# Altium project CPU_USB.PrjPcb
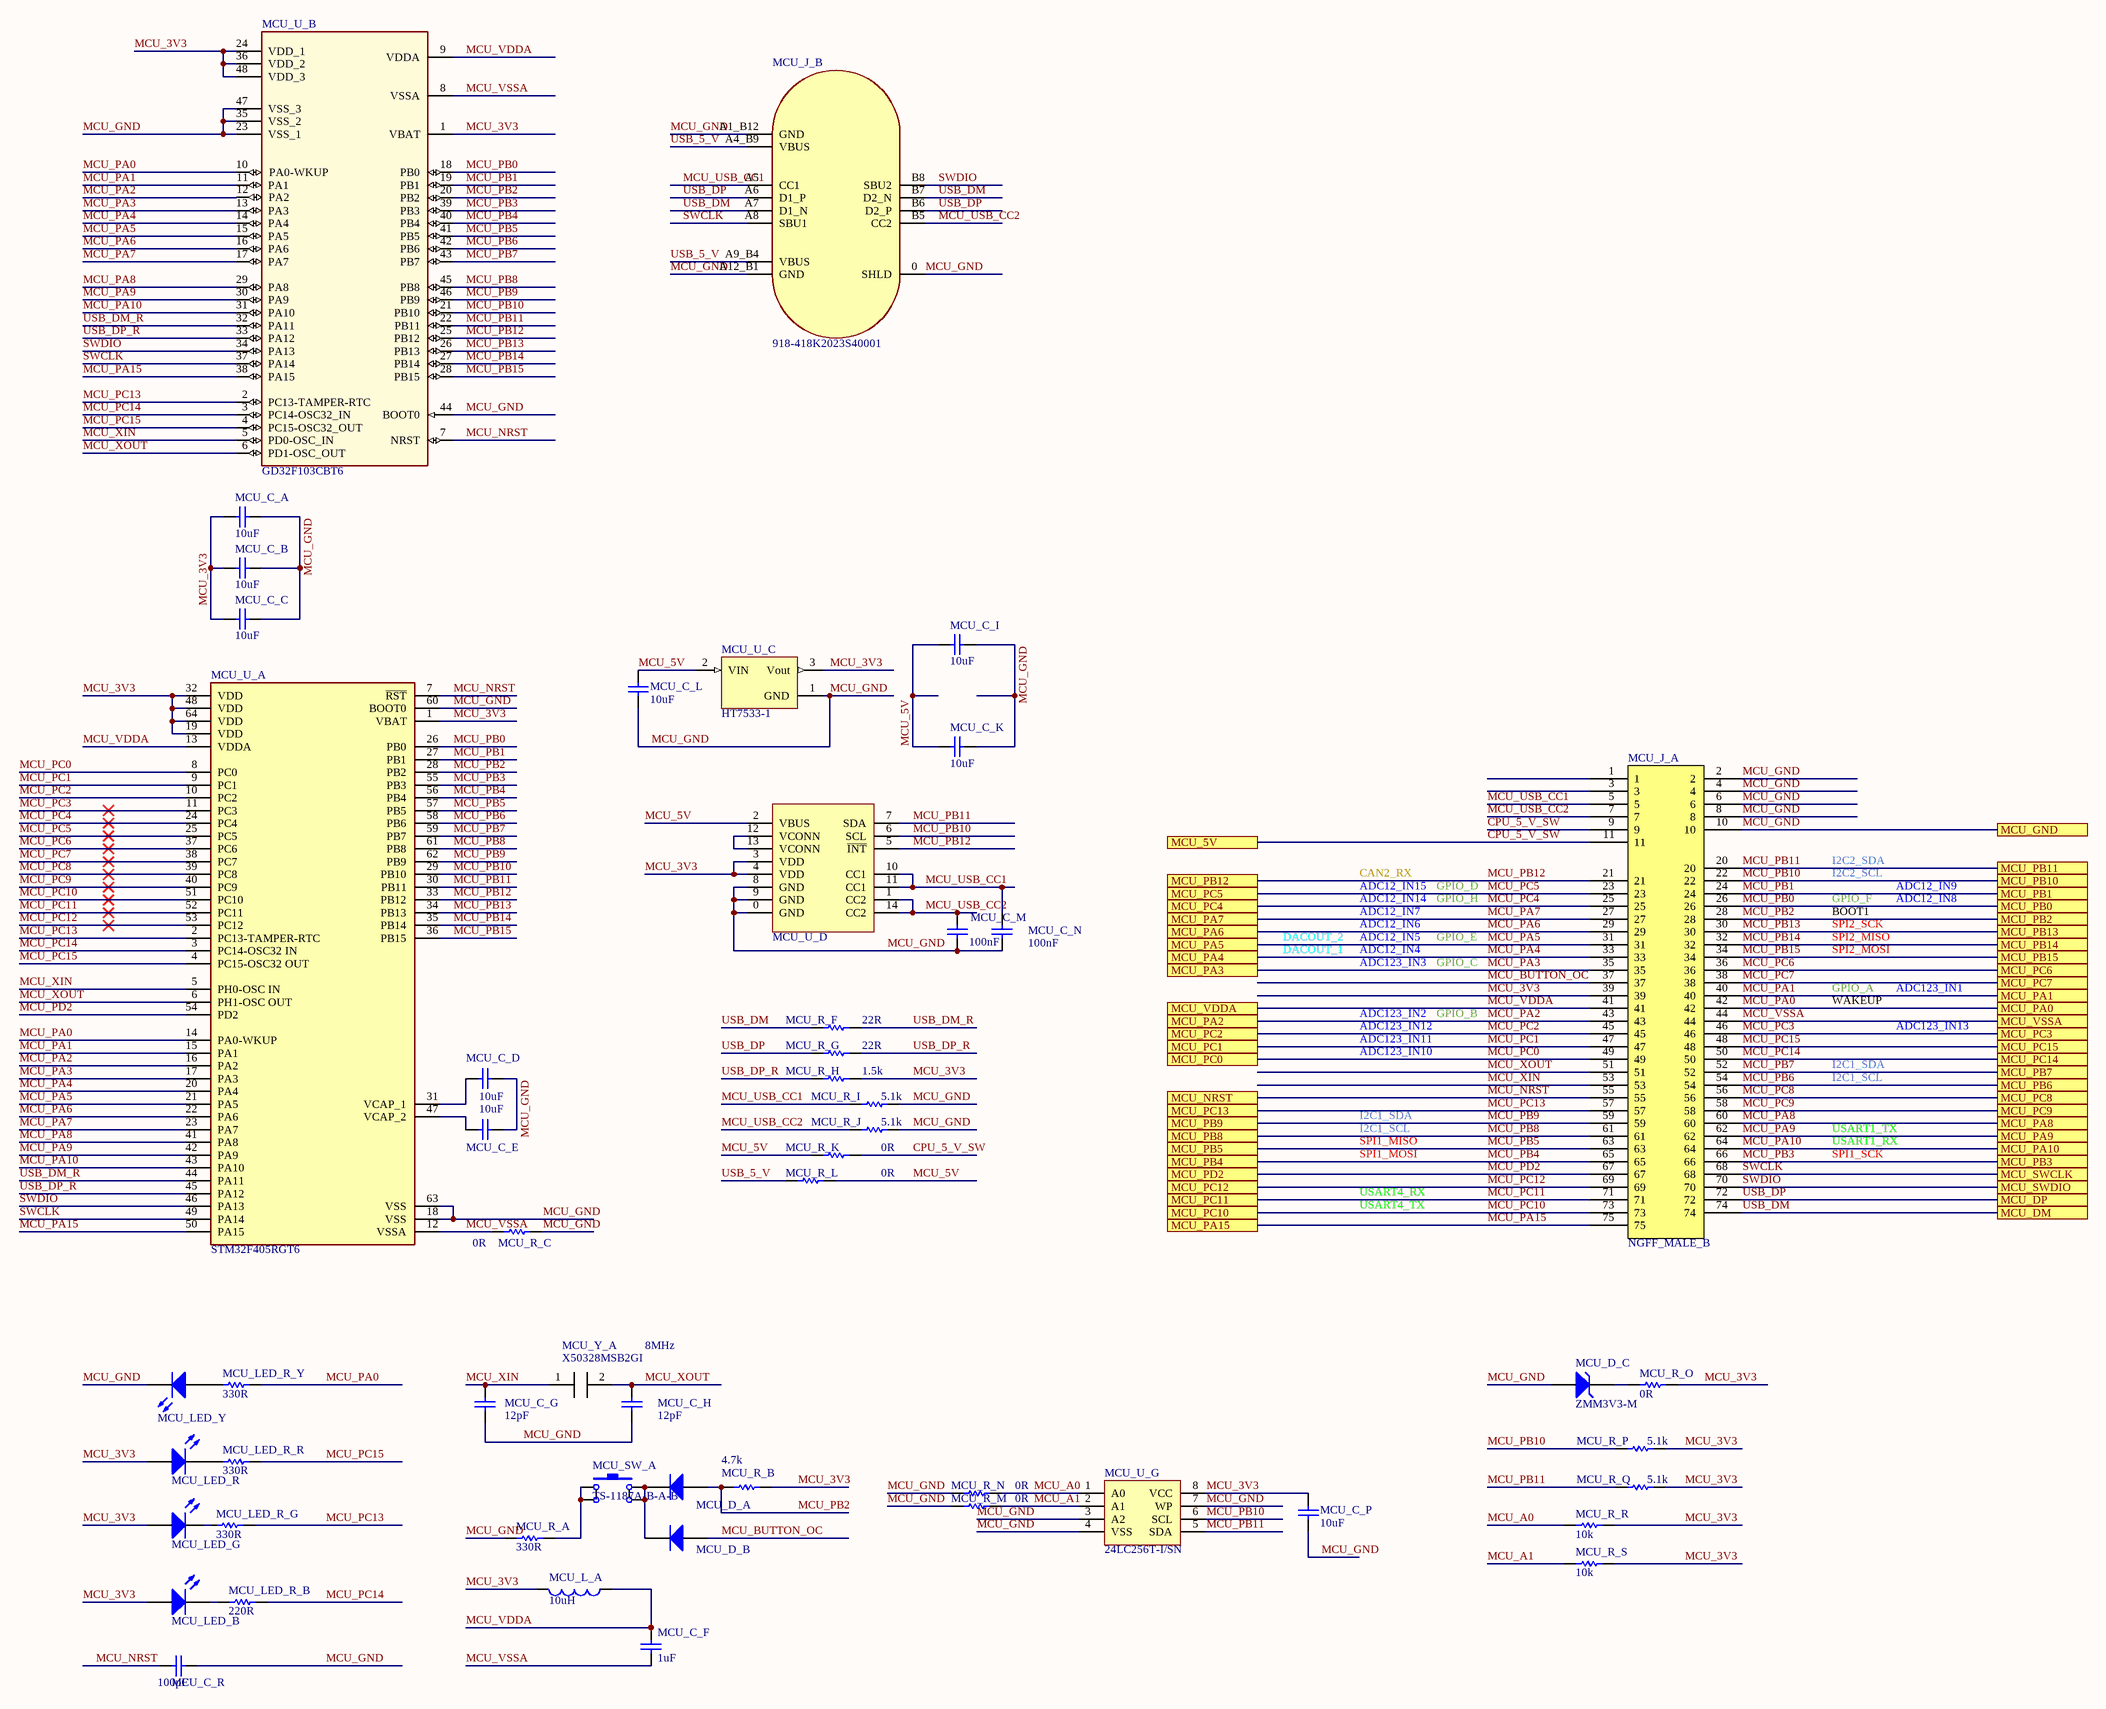
[diagram p0: CPU.SchDoc]
2 sheets, 76 parts. Net scope: flat (ports and power ports of the same name join across sheets).
Board file: CPU.PcbDoc
Sheets:
  CPU.SchDoc
  AFE.SchDoc

## Sheet CPU.SchDoc
size C

### Parts
MCU_C_A  value 10uF  [C_0402]  (hidden comment: CL05A106MQ5NUNC)
MCU_C_B  value 10uF  [C_0402]  (hidden comment: CL05A106MQ5NUNC)
MCU_C_C  value 10uF  [C_0402]  (hidden comment: CL05A106MQ5NUNC)
MCU_C_D  value 10uF  [C_0402]  (hidden comment: CL05A106MQ5NUNC)
MCU_C_E  value 10uF  [C_0402]  (hidden comment: CL05A106MQ5NUNC)
MCU_C_F  value 1uF  [C_0402]  (hidden comment: CL05A105KA5NQNC)
MCU_C_G  value 12pF  [C_0402]  (hidden comment: 0402CG120J500NT)
MCU_C_H  value 12pF  [C_0402]  (hidden comment: 0402CG120J500NT)
MCU_C_I  value 10uF  [C_0402]  (hidden comment: CL05A106MQ5NUNC)
MCU_C_K  value 10uF  [C_0402]  (hidden comment: CL05A106MQ5NUNC)
MCU_C_L  value 10uF  [C_0805]  (hidden comment: CL21A106KAYNNNE)
MCU_C_M  value 100nF  [C_0402]  (hidden comment: CL05B104KO5NNNC)
MCU_C_N  value 100nF  [C_0402]  (hidden comment: CL05B104KO5NNNC)
MCU_C_P  value 10uF  [C_0402]  (hidden comment: CL05A106MQ5NUNC)
MCU_C_R  value 100pF  [C_0402]  (hidden comment: 0402CG101J500NT)
MCU_D_A  1N4148WS  [SOD-323]  (value not drawn)
MCU_D_B  1N4148WS  [SOD-323]  (value not drawn)
MCU_D_C  ZMM3V3-M  [DO-213AA]
MCU_J_A  NGFF_MALE_B  [NGFF_MALE_B]
MCU_J_B  918-418K2023S40001  [918-418K2023S40001]
MCU_L_A  value 10uH  [L_0603]  (hidden comment: SDFL1608S100KTF)
MCU_LED_B  19-217/BHC-ZL1M2RY/3T  [D_0603]  (value not drawn)
MCU_LED_G  19-217/GHC-YR1S2/3T  [D_0603]  (value not drawn)
MCU_LED_R  KT-0603R  [D_0603]  (value not drawn)
MCU_LED_R_B  value 220R  [R_0402]  (hidden comment: 0402WGF2200TCE)
MCU_LED_R_G  value 330R  [R_0402]  (hidden comment: 0402WGF3300TCE)
MCU_LED_R_R  value 330R  [R_0402]  (hidden comment: 0402WGF3300TCE)
MCU_LED_R_Y  value 330R  [R_0402]  (hidden comment: 0402WGF3300TCE)
MCU_LED_Y  19-21UYC/S530-A4/TR8  [D_0603]  (value not drawn)
MCU_R_A  value 330R  [R_0402]  (hidden comment: 0402WGF3300TCE)
MCU_R_B  value 4.7k  [R_0402]  (hidden comment: 0402WGF4701TCE)
MCU_R_C  value 0R  [R_0402]  (hidden comment: 0402WGF0000TCE)
MCU_R_F  value 22R  [R_0402]  (hidden comment: 0402WGF220JTCE)
MCU_R_G  value 22R  [R_0402]  (hidden comment: 0402WGF220JTCE)
MCU_R_H  value 1.5k  [R_0402]  (hidden comment: 0402WGF1501TCE)
MCU_R_I  value 5.1k  [R_0402]  (hidden comment: 0402WGF5101TCE)
MCU_R_J  value 5.1k  [R_0402]  (hidden comment: 0402WGF5101TCE)
MCU_R_K  value 0R  [R_0402]  (hidden comment: 0402WGF0000TCE)
MCU_R_L  value 0R  [R_0402]  (hidden comment: 0402WGF0000TCE)
MCU_R_M  value 0R  [R_0402]  (hidden comment: 0402WGF0000TCE)
MCU_R_N  value 0R  [R_0402]  (hidden comment: 0402WGF0000TCE)
MCU_R_O  value 0R  [R_0402]  (hidden comment: 0402WGF0000TCE)
MCU_R_P  value 5.1k  [R_0402]  (hidden comment: 0402WGF5101TCE)
MCU_R_Q  value 5.1k  [R_0402]  (hidden comment: 0402WGF5101TCE)
MCU_R_R  value 10k  [R_0402]  (hidden comment: 0402WGF1002TCE)
MCU_R_S  value 10k  [R_0402]  (hidden comment: 0402WGF1002TCE)
MCU_SW_A  TS-1187A-B-A-B  [TS-1187A-C-C-B]
MCU_U_A  STM32F405RGT6  [QFP-64-P0.5MM]
MCU_U_B  GD32F103CBT6  [QFP-48-P0.5MM]
MCU_U_C  HT7533-1  [SOT-223-3]
MCU_U_D  FUSB302BMPX  [QFN-14-P0.5MM]  (value not drawn)
MCU_U_G  24LC256T-I/SN  [SOIC-8-P1.27-W3.5]
MCU_Y_A  X50328MSB2GI  value 8MHz  [YSX530GA]

### Ports
MCU_5V, MCU_DM, MCU_DP, MCU_GND, MCU_NRST, MCU_PA0, MCU_PA1, MCU_PA2, MCU_PA3, MCU_PA4, MCU_PA5, MCU_PA6, MCU_PA7, MCU_PA8, MCU_PA9, MCU_PA10, MCU_PA15, MCU_PB0, MCU_PB1, MCU_PB2, MCU_PB3, MCU_PB4, MCU_PB5, MCU_PB6, MCU_PB7, MCU_PB8, MCU_PB9, MCU_PB10, MCU_PB11, MCU_PB12, MCU_PB13, MCU_PB14, MCU_PB15, MCU_PC0, MCU_PC1, MCU_PC2, MCU_PC3, MCU_PC4, MCU_PC5, MCU_PC6, MCU_PC7, MCU_PC8, MCU_PC9, MCU_PC10, MCU_PC11, MCU_PC12, MCU_PC13, MCU_PC14, MCU_PC15, MCU_PD2, MCU_SWCLK, MCU_SWDIO, MCU_VDDA, MCU_VSSA

### Nets
CPU_5_V_SW: MCU_J_A.9 MCU_J_A.11 MCU_R_K.1 ; port MCU_5V
MCU_3V3: MCU_C_A.1 MCU_C_B.1 MCU_C_C.1 MCU_C_P.2 MCU_J_A.39 MCU_L_A.2 MCU_LED_B.2(A) MCU_LED_G.2(A) MCU_LED_R.2(A) MCU_R_B.1 MCU_R_H.2 MCU_R_O.2 MCU_R_P.2 MCU_R_Q.2 MCU_R_R.2 MCU_R_S.2 MCU_U_A.1(VBAT) MCU_U_A.19(VDD) MCU_U_A.32(VDD) MCU_U_A.48(VDD) MCU_U_A.64(VDD) MCU_U_B.1(VBAT) MCU_U_B.24(VDD_1) MCU_U_B.36(VDD_2) MCU_U_B.48(VDD_3) MCU_U_C.3(Vout) MCU_U_D.3(VDD) MCU_U_D.4(VDD) MCU_U_G.8(VCC)
MCU_5V: MCU_C_I.1 MCU_C_K.1 MCU_C_L.2 MCU_R_K.2 MCU_R_L.1 MCU_U_C.2(VIN) MCU_U_D.2(VBUS)
MCU_A0: MCU_R_N.1 MCU_R_R.1 MCU_U_G.1(A0)
MCU_A1: MCU_R_M.1 MCU_R_S.1 MCU_U_G.2(A1)
MCU_BUTTON_OC: MCU_D_B.2(A) MCU_J_A.37
MCU_GND: MCU_C_A.2 MCU_C_B.2 MCU_C_C.2 MCU_C_D.2 MCU_C_E.2 MCU_C_G.1 MCU_C_H.1 MCU_C_I.2 MCU_C_K.2 MCU_C_L.1 MCU_C_M.2 MCU_C_N.2 MCU_C_P.1 MCU_C_R.1 MCU_D_C.2(A) MCU_J_A.2 MCU_J_A.4 MCU_J_A.6 MCU_J_A.8 MCU_J_A.10 MCU_J_B.0(SHLD) MCU_J_B.A1_B12(GND) MCU_J_B.A12_B1(GND) MCU_LED_Y.1(K) MCU_R_A.2 MCU_R_C.1 MCU_R_I.2 MCU_R_J.2 MCU_R_M.2 MCU_R_N.2 MCU_U_A.18(VSS) MCU_U_A.60(BOOT0) MCU_U_A.63(VSS) MCU_U_B.23(VSS_1) MCU_U_B.35(VSS_2) MCU_U_B.44(BOOT0) MCU_U_B.47(VSS_3) MCU_U_C.1(GND) MCU_U_D.0(GND) MCU_U_D.8(GND) MCU_U_D.9(GND) MCU_U_G.3(A2) MCU_U_G.4(VSS) MCU_U_G.7(WP) ; port MCU_GND
MCU_NRST: MCU_C_R.2 MCU_J_A.55 MCU_U_A.7(~{RST}) MCU_U_B.7(NRST) ; port MCU_NRST
MCU_PA0: MCU_J_A.42 MCU_LED_R_Y.1 MCU_U_A.14(PA0-WKUP) MCU_U_B.10(PA0-WKUP) ; port MCU_PA0
MCU_PA1: MCU_J_A.40 MCU_U_A.15(PA1) MCU_U_B.11(PA1) ; port MCU_PA1
MCU_PA2: MCU_J_A.43 MCU_U_A.16(PA2) MCU_U_B.12(PA2) ; port MCU_PA2
MCU_PA3: MCU_J_A.35 MCU_U_A.17(PA3) MCU_U_B.13(PA3) ; port MCU_PA3
MCU_PA4: MCU_J_A.33 MCU_U_A.20(PA4) MCU_U_B.14(PA4) ; port MCU_PA4
MCU_PA5: MCU_J_A.31 MCU_U_A.21(PA5) MCU_U_B.15(PA5) ; port MCU_PA5
MCU_PA6: MCU_J_A.29 MCU_U_A.22(PA6) MCU_U_B.16(PA6) ; port MCU_PA6
MCU_PA7: MCU_J_A.27 MCU_U_A.23(PA7) MCU_U_B.17(PA7) ; port MCU_PA7
MCU_PA8: MCU_J_A.60 MCU_U_A.41(PA8) MCU_U_B.29(PA8) ; port MCU_PA8
MCU_PA9: MCU_J_A.62 MCU_U_A.42(PA9) MCU_U_B.30(PA9) ; port MCU_PA9
MCU_PA10: MCU_J_A.64 MCU_U_A.43(PA10) MCU_U_B.31(PA10) ; port MCU_PA10
MCU_PA15: MCU_J_A.75 MCU_U_A.50(PA15) MCU_U_B.38(PA15) ; port MCU_PA15
MCU_PB0: MCU_J_A.26 MCU_U_A.26(PB0) MCU_U_B.18(PB0) ; port MCU_PB0
MCU_PB1: MCU_J_A.24 MCU_U_A.27(PB1) MCU_U_B.19(PB1) ; port MCU_PB1
MCU_PB2: MCU_D_A.2(A) MCU_J_A.28 MCU_R_B.2 MCU_U_A.28(PB2) MCU_U_B.20(PB2) ; port MCU_PB2
MCU_PB3: MCU_J_A.66 MCU_U_A.55(PB3) MCU_U_B.39(PB3) ; port MCU_PB3
MCU_PB4: MCU_J_A.65 MCU_U_A.56(PB4) MCU_U_B.40(PB4) ; port MCU_PB4
MCU_PB5: MCU_J_A.63 MCU_U_A.57(PB5) MCU_U_B.41(PB5) ; port MCU_PB5
MCU_PB6: MCU_J_A.54 MCU_U_A.58(PB6) MCU_U_B.42(PB6) ; port MCU_PB6
MCU_PB7: MCU_J_A.52 MCU_U_A.59(PB7) MCU_U_B.43(PB7) ; port MCU_PB7
MCU_PB8: MCU_J_A.61 MCU_U_A.61(PB8) MCU_U_B.45(PB8) ; port MCU_PB8
MCU_PB9: MCU_J_A.59 MCU_U_A.62(PB9) MCU_U_B.46(PB9) ; port MCU_PB9
MCU_PB10: MCU_J_A.22 MCU_R_P.1 MCU_U_A.29(PB10) MCU_U_B.21(PB10) MCU_U_D.6(SCL) MCU_U_G.6(SCL) ; port MCU_PB10
MCU_PB11: MCU_J_A.20 MCU_R_Q.1 MCU_U_A.30(PB11) MCU_U_B.22(PB11) MCU_U_D.7(SDA) MCU_U_G.5(SDA) ; port MCU_PB11
MCU_PB12: MCU_J_A.21 MCU_U_A.33(PB12) MCU_U_B.25(PB12) MCU_U_D.5(~{INT}) ; port MCU_PB12
MCU_PB13: MCU_J_A.30 MCU_U_A.34(PB13) MCU_U_B.26(PB13) ; port MCU_PB13
MCU_PB14: MCU_J_A.32 MCU_U_A.35(PB14) MCU_U_B.27(PB14) ; port MCU_PB14
MCU_PB15: MCU_J_A.34 MCU_U_A.36(PB15) MCU_U_B.28(PB15) ; port MCU_PB15
MCU_PC0: MCU_J_A.49 MCU_U_A.8(PC0) ; port MCU_PC0
MCU_PC1: MCU_J_A.47 MCU_U_A.9(PC1) ; port MCU_PC1
MCU_PC2: MCU_J_A.45 MCU_U_A.10(PC2) ; port MCU_PC2
MCU_PC3: MCU_J_A.46 MCU_U_A.11(PC3) ; port MCU_PC3
MCU_PC4: MCU_J_A.25 MCU_U_A.24(PC4) ; port MCU_PC4
MCU_PC5: MCU_J_A.23 MCU_U_A.25(PC5) ; port MCU_PC5
MCU_PC6: MCU_J_A.36 MCU_U_A.37(PC6) ; port MCU_PC6
MCU_PC7: MCU_J_A.38 MCU_U_A.38(PC7) ; port MCU_PC7
MCU_PC8: MCU_J_A.56 MCU_U_A.39(PC8) ; port MCU_PC8
MCU_PC9: MCU_J_A.58 MCU_U_A.40(PC9) ; port MCU_PC9
MCU_PC10: MCU_J_A.73 MCU_U_A.51(PC10) ; port MCU_PC10
MCU_PC11: MCU_J_A.71 MCU_U_A.52(PC11) ; port MCU_PC11
MCU_PC12: MCU_J_A.69 MCU_U_A.53(PC12) ; port MCU_PC12
MCU_PC13: MCU_J_A.57 MCU_LED_R_G.1 MCU_U_A.2(PC13-TAMPER-RTC) MCU_U_B.2(PC13-TAMPER-RTC) ; port MCU_PC13
MCU_PC14: MCU_J_A.50 MCU_LED_R_B.1 MCU_U_A.3(PC14-OSC32_IN) MCU_U_B.3(PC14-OSC32_IN) ; port MCU_PC14
MCU_PC15: MCU_J_A.48 MCU_LED_R_R.1 MCU_U_A.4(PC15-OSC32_OUT) MCU_U_B.4(PC15-OSC32_OUT) ; port MCU_PC15
MCU_PD2: MCU_J_A.67 MCU_U_A.54(PD2) ; port MCU_PD2
MCU_USB_CC1: MCU_C_N.1 MCU_J_A.5 MCU_J_B.A5(CC1) MCU_R_I.1 MCU_U_D.10(CC1) MCU_U_D.11(CC1)
MCU_USB_CC2: MCU_C_M.1 MCU_J_A.7 MCU_J_B.B5(CC2) MCU_R_J.1 MCU_U_D.1(CC2) MCU_U_D.14(CC2)
MCU_VDDA: MCU_C_F.2 MCU_J_A.41 MCU_L_A.1 MCU_U_A.13(VDDA) MCU_U_B.9(VDDA) ; port MCU_VDDA
MCU_VSSA: MCU_C_F.1 MCU_J_A.44 MCU_R_C.2 MCU_U_A.12(VSSA) MCU_U_B.8(VSSA) ; port MCU_VSSA
MCU_XIN: MCU_C_G.2 MCU_J_A.53 MCU_U_A.5(PH0-OSC_IN) MCU_U_B.5(PD0-OSC_IN) MCU_Y_A.1
MCU_XOUT: MCU_C_H.2 MCU_J_A.51 MCU_U_A.6(PH1-OSC_OUT) MCU_U_B.6(PD1-OSC_OUT) MCU_Y_A.2
SWCLK: MCU_J_A.68 MCU_J_B.A8(SBU1) MCU_U_A.49(PA14) MCU_U_B.37(PA14) ; port MCU_SWCLK
SWDIO: MCU_J_A.70 MCU_J_B.B8(SBU2) MCU_U_A.46(PA13) MCU_U_B.34(PA13) ; port MCU_SWDIO
USB_5_V: MCU_J_B.A4_B9(VBUS) MCU_J_B.A9_B4(VBUS) MCU_R_L.2
USB_DM: MCU_J_A.74 MCU_J_B.A7(D1_N) MCU_J_B.B7(D2_N) MCU_R_F.1 ; port MCU_DM
USB_DM_R: MCU_R_F.2 MCU_U_A.44(PA11) MCU_U_B.32(PA11)
USB_DP: MCU_J_A.72 MCU_J_B.A6(D1_P) MCU_J_B.B6(D2_P) MCU_R_G.1 ; port MCU_DP
USB_DP_R: MCU_R_G.2 MCU_R_H.1 MCU_U_A.45(PA12) MCU_U_B.33(PA12)
NetMCU_C_D_1: MCU_C_D.1 MCU_U_A.31(VCAP_1)
NetMCU_C_E_1: MCU_C_E.1 MCU_U_A.47(VCAP_2)
NetMCU_D_A_1: MCU_D_A.1(K) MCU_D_B.1(K) MCU_SW_A.2 MCU_SW_A.2B
NetMCU_D_C_1: MCU_D_C.1(K) MCU_R_O.1
NetMCU_LED_B_1: MCU_LED_B.1(K) MCU_LED_R_B.2
NetMCU_LED_G_1: MCU_LED_G.1(K) MCU_LED_R_G.2
NetMCU_LED_R_1: MCU_LED_R.1(K) MCU_LED_R_R.2
NetMCU_LED_R_Y_2: MCU_LED_R_Y.2 MCU_LED_Y.2(A)
NetMCU_R_A_1: MCU_R_A.1 MCU_SW_A.1 MCU_SW_A.1B
NetMCU_U_D_12: MCU_U_D.12(VCONN) MCU_U_D.13(VCONN)

Not connected (* = marked no-connect by the designer): MCU_J_A 1 3

### Notes on the sheet
- ADC12_IN14
- ADC12_IN15
- CAN2_RX
- GPIO_D
- GPIO_H
- I2C2_SDA
- I2C2_SCL
- GPIO_F
- ADC12_IN8
- ADC12_IN9
- DACOUT_1
- DACOUT_2
- ADC12_IN4
- ADC12_IN5
- ADC12_IN6
- ADC12_IN7
- GPIO_E
- SPI2_SCK
- SPI2_MISO
- SPI2_MOSI
- BOOT1
- ADC123_IN2
- ADC123_IN3
- ADC123_IN12
- GPIO_B
- GPIO_C
- GPIO_A
- WAKEUP
- ADC123_IN1
- ADC123_IN13
- ADC123_IN10
- ADC123_IN11
- I2C1_SDA
- I2C1_SCL
- SPI1_MISO
- SPI1_MOSI
- USART1_TX
- USART1_RX
- SPI1_SCK
- USART4_RX
- USART4_TX

### Library data of the parts
MCU_C_A MCU_C_B MCU_C_C MCU_C_D MCU_C_E MCU_C_I MCU_C_K MCU_C_P = CL05A106MQ5NUNC: C - CAPACITOR - MLCC - 10uF - 6.3V - 0402; WVDC: 6.3; LCSC Part #: C15525; JLC Availability: Basic
MCU_C_F = CL05A105KA5NQNC: C - CAPACITOR - MLCC - 1uF - 25V - 0402; WVDC: 16; LCSC Part #: C52923; JLC Availability: Basic
MCU_C_G MCU_C_H = 0402CG120J500NT: C - CAPACITOR - MLCC - 12pF - 50V - 0402; WVDC: 50; LCSC Part #: C1547; JLC Availability: Basic
MCU_C_L = CL21A106KAYNNNE: C - CAPACITOR - MLCC - 10uF - 25V - 0805; WVDC: 25; LCSC Part #: C15850; Availability: Basic
MCU_C_M MCU_C_N = CL05B104KO5NNNC: C - CAPACITOR - MLCC - 100nF - 16V - 0402; WVDC: 16; LCSC Part #: C1525; JLC Availability: Basic
MCU_C_R = 0402CG101J500NT: C - CAPACITOR - MLCC - 100pF - 50V - 0402; LCSC Part #: C1546; JLC Availability: Extended
MCU_D_A MCU_D_B = 1N4148WS: D - DIODE - FAST TRR - 100V - 150mA - 4ns; LCSC Part #: C2128; JLC Availability: Basic; PIV: 100V; If: 150mA; Trr: 4ns
MCU_D_C = ZMM3V3-M: D - DIODE - ZENER - 3.3V - 500mW; LCSC Part #: C8056; JLC Availability: Basic
MCU_J_A = NGFF_MALE_B: J - JACK - NGFF Male Finger, B Key; Manufacturer: Kyocera; Manufacturer P/N: 245863050024829
MCU_J_B = 918-418K2023S40001: J - JACK - USB - Type C - Recepticle - SMT - 90°; JLC Availability: LCSC; LCSC Part #: C167321
MCU_L_A = SDFL1608S100KTF: L - INDUCTOR - 10uH - 0603; LCSC Part #: C1035; JLC Availability: Basic
MCU_LED_B = 19-217/BHC-ZL1M2RY/3T: D - LED - 0603 - Blue; LCSC Part #: C72041; JLC Availability: Basic
MCU_LED_G = 19-217/GHC-YR1S2/3T: D - LED - 0603 - Green; LCSC Part #: C72043; JLC Availability: Basic
MCU_LED_R = KT-0603R: D - LED - 0603 - Red; LCSC Part #: C2286; JLC Availability: Basic
MCU_LED_R_B = 0402WGF2200TCE: R - RESISTOR - SMD - 220R - 1% - 0402; LCSC Part #: C25091; JLC Availability: Basic
MCU_LED_R_G MCU_LED_R_R MCU_LED_R_Y MCU_R_A = 0402WGF3300TCE: R - RESISTOR - SMD - 330R - 1% - 0402; LCSC Part #: C25104; JLC Availability: Basic
MCU_LED_Y = 19-21UYC/S530-A4/TR8: D - LED - 0603 - Yellow (Sodium); LCSC Part #: C409441; JLC Availability: Extended
MCU_R_B = 0402WGF4701TCE: R - RESISTOR - SMD - 4.7k - 1% - 0402; LCSC Part #: C25900; JLC Availability: Basic
MCU_R_C MCU_R_K MCU_R_L MCU_R_M MCU_R_N MCU_R_O = 0402WGF0000TCE: R - RESISTOR - SMD - 0R - 1% - 0402; LCSC Part #: C17168; JLC Availability: Basic
MCU_R_F MCU_R_G = 0402WGF220JTCE: R - RESISTOR - SMD - 22R - 1% - 0402; LCSC Part #: C25092; JLC Availability: Basic
MCU_R_H = 0402WGF1501TCE: R - RESISTOR - SMD - 1.5k - 1% - 0402; LCSC Part #: C25867; JLC Availability: Basic
MCU_R_I MCU_R_J MCU_R_P MCU_R_Q = 0402WGF5101TCE: R - RESISTOR - SMD - 5.1k - 1% - 0402; LCSC Part #: C25905; JLC Availability: Basic
MCU_R_R MCU_R_S = 0402WGF1002TCE: R - RESISTOR - SMD - 10k - 1% - 0402; LCSC Part #: C25744; JLC Availability: Basic
MCU_SW_A = TS-1187A-B-A-B: SW - SWITCH - SPST - NO - Top Actuated Surface Mount; LCSC Part #: C318884; JLC Availability: Basic
MCU_U_A = STM32F405RGT6: U - IC - MCU 32BIT 1MB FLASH 64LQFP; ComponentLink2Description: Datasheet; ComponentLink1URL: https://upverter.com/upn/revision/179c87d5c3d4f257/; ComponentLink1Description: Upverter; ComponentLink2URL: http://www.st.com/content/ccc/resource/technical/document/datasheet/33/d4/6f/1d/df/0b/4c/6d/CD00161566.pdf/files/CD00161566.pdf/jcr:content/translations/en.CD00161566.pdf; LCSC Part #: C15742; JLC Availability: Extended
MCU_U_B = GD32F103CBT6: U - IC - MCU, 128 KB Flash, 20 KB Internal RAM, 37 I/Os, 48-pin LQFP, -40 to 85 degC; FLASH Size (Prog) (kB): 128; I/Os (High Current): 37; Internal RAM Size (kB): 20; Operating Frequency(F) (Processor speed) (MHz): 72; ComponentLink1Description: Manufacturer URL; ComponentLink1URL: http://www.st.com/web/en/home.html; ComponentLink2Description: Datasheet; ComponentLink2URL: http://www.st.com/st-web-ui/static/active/en/resource/technical/document/datasheet/CD00161566.pdf; ComponentLink3Description: Package Specification; ComponentLink3URL: http://www.st.com/st-web-ui/static/active/en/resource/technical/document/datasheet/DM00058181.pdf; LCSC Part #: C77979; JLC Availability: Extended
MCU_U_C = HT7533-1: U - IC - 3V3 Power Regulator; VOut: 3.3; LCSC Part #: C14289; JLC Availability: Basic
MCU_U_D = FUSB302BMPX: U - IC - USB PD PHY; JLC Availability: Extended; LCSC Part #: C442699
MCU_U_G = 24LC256T-I/SN: U - IC - EEPROM 256k; LCSC Part #: C5458; JLC Availability: Extended; Storage: 256k
MCU_Y_A = X50328MSB2GI: Y - RESONATOR - 8MHZ ±10PPM - SMD-5032; Availability: Basic; LCSC Part #: C115962

## Sheet AFE.SchDoc
size A
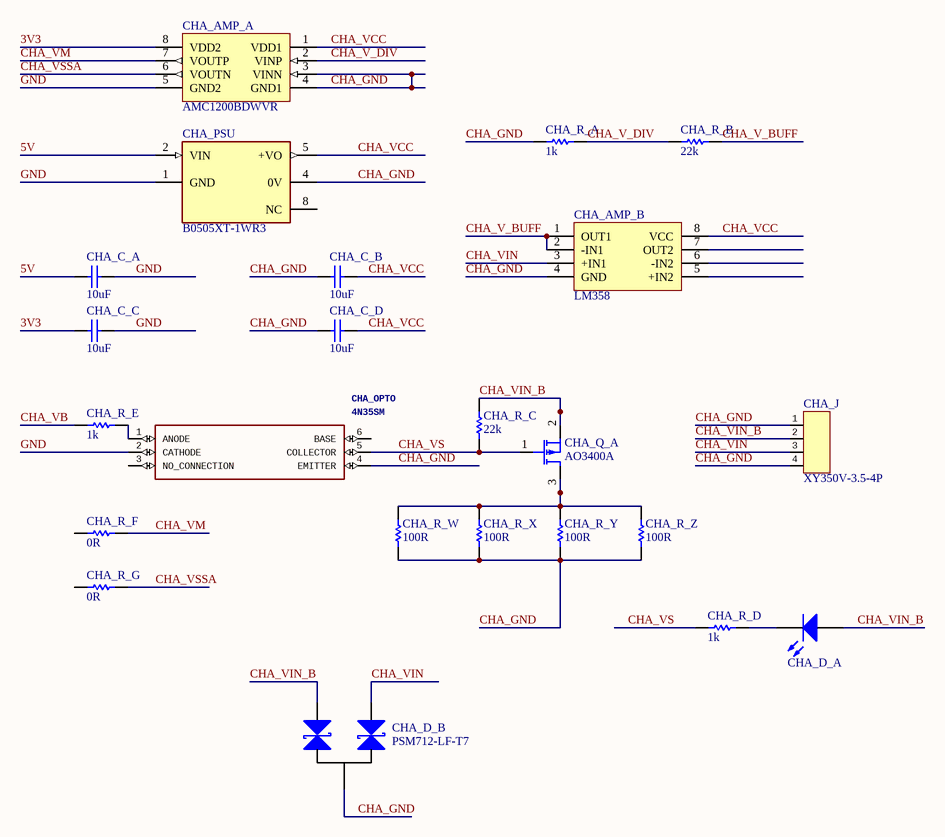
[diagram p1: AFE.SchDoc]

### Parts
CHA_AMP_A  AMC1200BDWVR  [SOIC-8-P1.27-W7.5]
CHA_AMP_B  LM358  [SOIC-8-P1.27-W3.5]
CHA_C_A  value 10uF  [C_0603]  (hidden comment: CL10A106MA8NRNC)
CHA_C_B  value 10uF  [C_0603]  (hidden comment: CL10A106MA8NRNC)
CHA_C_C  value 10uF  [C_0603]  (hidden comment: CL10A106MA8NRNC)
CHA_C_D  value 10uF  [C_0603]  (hidden comment: CL10A106MA8NRNC)
CHA_D_A  KT-0603R  [D_0603]  (value not drawn)
CHA_D_B  PSM712-LF-T7  [TO-236AB]
CHA_J  XY350V-3.5-4P  [XY350V-3.5-4P]
CHA_OPTO  4N35SM  [SOT254P916X508-6N]
CHA_PSU  B0505XT-1WR3  [CONV_B0512XT-1WR3]
CHA_Q_A  AO3400A  [TO-236AB]
CHA_R_A  value 1k  [R_0603]  (hidden comment: 0603WAF1001T5E)
CHA_R_B  value 22k  [R_0603]  (hidden comment: 0603WAF2202T5E)
CHA_R_C  value 22k  [R_0603]  (hidden comment: 0603WAF2202T5E)
CHA_R_D  value 1k  [R_0603]  (hidden comment: 0603WAF1001T5E)
CHA_R_E  value 1k  [R_0603]  (hidden comment: 0603WAF1001T5E)
CHA_R_F  value 0R  [R_0603]  (hidden comment: 0603WAF0000T5E)
CHA_R_G  value 0R  [R_0603]  (hidden comment: 0603WAF0000T5E)
CHA_R_W  value 100R  [R_1206]  (hidden comment: 1206W4F1000T5E)
CHA_R_X  value 100R  [R_1206]  (hidden comment: 1206W4F1000T5E)
CHA_R_Y  value 100R  [R_1206]  (hidden comment: 1206W4F1000T5E)
CHA_R_Z  value 100R  [R_1206]  (hidden comment: 1206W4F1000T5E)

### Nets
3V3: CHA_AMP_A.8(VDD2) CHA_C_C.2
5V: CHA_C_A.2 CHA_PSU.2(VIN)
CHA_GND: CHA_AMP_A.3(VINN) CHA_AMP_A.4(GND1) CHA_AMP_B.4(GND) CHA_C_B.2 CHA_C_D.2 CHA_D_B.3(A) CHA_J.1 CHA_J.4 CHA_OPTO.4(EMITTER) CHA_PSU.4(0V) CHA_R_A.1 CHA_R_W.1 CHA_R_X.1 CHA_R_Y.1 CHA_R_Z.1
CHA_V_BUFF: CHA_AMP_B.1(OUT1) CHA_AMP_B.2(-IN1) CHA_R_B.2
CHA_V_DIV: CHA_AMP_A.2(VINP) CHA_R_A.2 CHA_R_B.1
CHA_VB: CHA_R_E.1
CHA_VCC: CHA_AMP_A.1(VDD1) CHA_AMP_B.8(VCC) CHA_C_B.1 CHA_C_D.1 CHA_PSU.5(+VO)
CHA_VIN: CHA_AMP_B.3(+IN1) CHA_D_B.2(K) CHA_J.3
CHA_VIN_B: CHA_D_A.2(A) CHA_D_B.1(K) CHA_J.2 CHA_Q_A.2(S) CHA_R_C.2
CHA_VM: CHA_AMP_A.7(VOUTP) CHA_R_F.2
CHA_VS: CHA_OPTO.5(COLLECTOR) CHA_Q_A.1(G) CHA_R_C.1 CHA_R_D.1
CHA_VSSA: CHA_AMP_A.6(VOUTN) CHA_R_G.2
GND: CHA_AMP_A.5(GND2) CHA_C_A.1 CHA_C_C.1 CHA_OPTO.2(CATHODE) CHA_PSU.1(GND)
NetCHA_D_A_1: CHA_D_A.1(K) CHA_R_D.2
NetCHA_OPTO_1: CHA_OPTO.1(ANODE) CHA_R_E.2
NetCHA_Q_A_3: CHA_Q_A.3(D) CHA_R_W.2 CHA_R_X.2 CHA_R_Y.2 CHA_R_Z.2

Not connected (* = marked no-connect by the designer): CHA_AMP_B 5(+IN2) 6(-IN2) 7(OUT2); CHA_OPTO 3(NO_CONNECTION) 6(BASE); CHA_PSU 8(NC); CHA_R_F 1; CHA_R_G 1

### Library data of the parts
CHA_AMP_A = AMC1200BDWVR: U - IC - 100KHz ISOLATION AMPLIFIER; Speed: 100KHz; LCSC Part #: C79905; JLC Availability: Extended
CHA_AMP_B = LMV358IDR: U - IC - OP AMP (DUAL); Speed: 0.4V/us; LCSC Part #: C63813; JLC Availability: Extended
CHA_C_A CHA_C_B CHA_C_C CHA_C_D = CL10A106MA8NRNC: C - CAPACITOR - MLCC - 10uF - 25V - 0603; WVDC: 25; LCSC Part #: C96446; Availability: Basic
CHA_D_A = KT-0603R: D - LED - 0603 - Red; LCSC Part #: C2286; JLC Availability: Basic
CHA_D_B = PSM712-LF-T7: D - DIODE - TVS x2 - 7.2V; Vrrm: 7; If: 1A; LCSC Part #: C32677; JLC Availability: Basic
CHA_J = XY350V-3.5-4P: J - JACK - TERMINAL - 4P - RIGHT - MALE; LCSC Part #: C557656; JLC Availability: Extended
CHA_OPTO = 4N35SM: Q - OPTOCOUPLER - 4170 V - 100% CTR; Manufacturer_Name: onsemi; GateName_1: G$1; SymbolName_1: 4N35SM; LibraryName: 4N35SM; DeviceSetName: 4N35SM; Package: SOT254P916X508-6N; LCSC Part #: C258228; Mouser_Price-Stock: https://www.mouser.co.uk/ProductDetail/onsemi-Fairchild/4N35SM?qs=VZOZQ19d7%2FIRbTYJunTCyQ%3D%3D; Manufacturer_Part_Number: 4N35SM; Height: 5.08mm
CHA_PSU = B0505XT-1WR3: T - Isolated Module DC DC Converter 5 -> 5V 200mA - DIP; MF: EVISUN; LCSC Part #: C19188495; Value: *; MP: B0505XT-1WR3; SnapEDA_Link: https://www.snapeda.com/parts/B0512XT-1WR3/MORNSUN/view-part/?ref=snap; Check_prices: https://www.snapeda.com/parts/B0512XT-1WR3/MORNSUN/view-part/?ref=eda
CHA_Q_A = AO3400A: Q - TRANSISTOR - MOSFET (P) - 20V - 3.4A - 0.26 Ohm; WVDC: 20; JLC Availability: Basic; LCSC Part #: C20917
CHA_R_A CHA_R_D CHA_R_E = 0603WAF1001T5E: R - RESISTOR - SMD - 1k - 1% - 0603; LCSC Part #: C21190; JLC Availability: Basic
CHA_R_B CHA_R_C = 0603WAF2202T5E: R - RESISTOR - SMD - 22k - 1% - 0603; LCSC Part #: C31850; JLC Availability: Basic
CHA_R_F CHA_R_G = 0603WAF0000T5E: R - RESISTOR - SMD - 0R - 1% - 0603; LCSC Part #: C21189; JLC Availability: Basic
CHA_R_W CHA_R_X CHA_R_Y CHA_R_Z = 1206W4F1000T5E: R - RESISTOR - SMD - 100R - 1% - 1206; LCSC Part #: C17901; JLC Availability: Basic

## Assembly variants
F4: not fitted MCU_J_C MCU_J_D MCU_U_B MCU_U_H
F1: not fitted MCU_J_C MCU_J_D MCU_U_A MCU_U_D MCU_U_H
F4_USB_ONLY: not fitted MCU_ETH_C_A MCU_ETH_C_B MCU_ETH_C_C MCU_ETH_C_D MCU_ETH_C_E MCU_ETH_C_F MCU_ETH_C_G MCU_ETH_C_H MCU_ETH_C_I MCU_ETH_C_J MCU_ETH_C_K MCU_ETH_C_L MCU_ETH_C_M MCU_ETH_C_O MCU_ETH_C_P MCU_ETH_C_Q MCU_ETH_C_R MCU_ETH_C_S MCU_ETH_C_T MCU_ETH_D_A MCU_ETH_D_B MCU_ETH_D_C MCU_ETH_D_D MCU_ETH_D_E MCU_ETH_D_F MCU_ETH_D_G MCU_ETH_D_H MCU_ETH_L_A MCU_ETH_NT_E MCU_ETH_R_A MCU_ETH_R_B MCU_ETH_R_C MCU_ETH_R_D MCU_ETH_R_E MCU_ETH_R_F MCU_ETH_R_G MCU_ETH_R_H MCU_ETH_R_I MCU_ETH_R_J MCU_ETH_R_K MCU_ETH_R_L MCU_ETH_R_M MCU_ETH_R_N MCU_ETH_R_O MCU_ETH_T_A MCU_J_B MCU_J_C MCU_J_E MCU_R_SCKA MCU_U_B MCU_U_D MCU_U_E MCU_U_H MCU_Y_B